# EAGLE design schema (EAGLE 9.6.2)
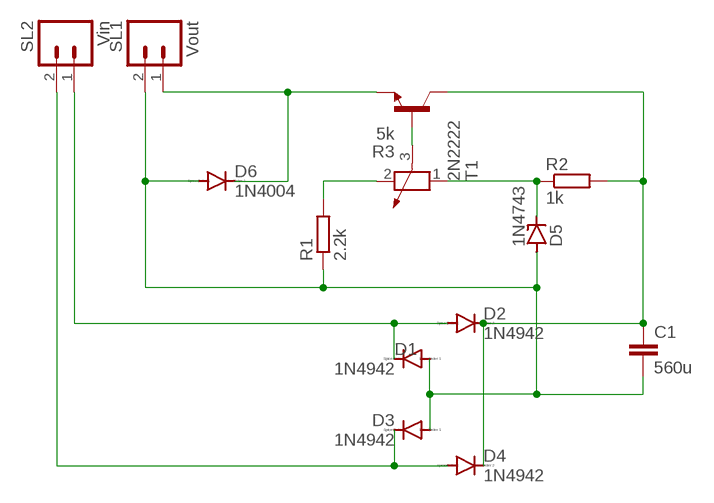
[diagram p0: schematic, sheet 1]

## Parts
C1  560u  C-EU025-025X050  [C025-025X050]
D1  1N4942  [DO41-10]
D2  1N4942  [DO41-10]
D3  1N4942  [DO41-10]
D4  1N4942  [DO41-10]
D5  1N4743  1N4728  [DO41Z10]
D6  1N4004  [DO41-10]
R1  2.2k  R-EU_0204/7  [0204/7]
R2  1k  R-EU_0204/7  [0204/7]
R3  5k  POTENTIOMETER_PT-10  [PT-10]
SL1  Vout  M02  [02P]
SL2  Vin  M02  [02P]
T1  2N2222  [TO18]

## Nets
N$1: D6.C SL1.1 T1.1(E)
N$3: C1.2 D1.A D3.A D5.A D6.A R1.1 SL1.2
N$4: D5.C R2.1 R3.1
N$5: R1.2 R3.2
N$6: R3.3 T1.2(B)
N$7: D3.C D4.A SL2.2
N$8: C1.1 D2.C D4.C R2.2 T1.3(C)
N$9: D1.C D2.A SL2.1

## Library data of the parts
C1 = rcl:C-EU: CAPACITOR, European symbol; SPICEPREFIX: C
D1-D4 = diode:1N4942: DIODE 1.0 A, 200 V, 150 ns
D5 = diode:1N4728: Z DIODE 3.3 V, 1W, 5 percent
D6 = diode:1N4004: DIODE general purpose rectifier, 1 A
R1 R2 = rcl:R-EU_: RESISTOR, European symbol; SPICEPREFIX: R
R3 = rcl:POTENTIOMETER_: Potentiometer; SPICEMODEL: POT; SPICEPREFIX: X
SL1 SL2 = con-amp-quick:M02: AMP QUICK CONNECTOR; OC_FARNELL: unknown; OC_NEWARK: unknown
T1 = transistor:2N2222: NPN TRANSISTOR

## Board
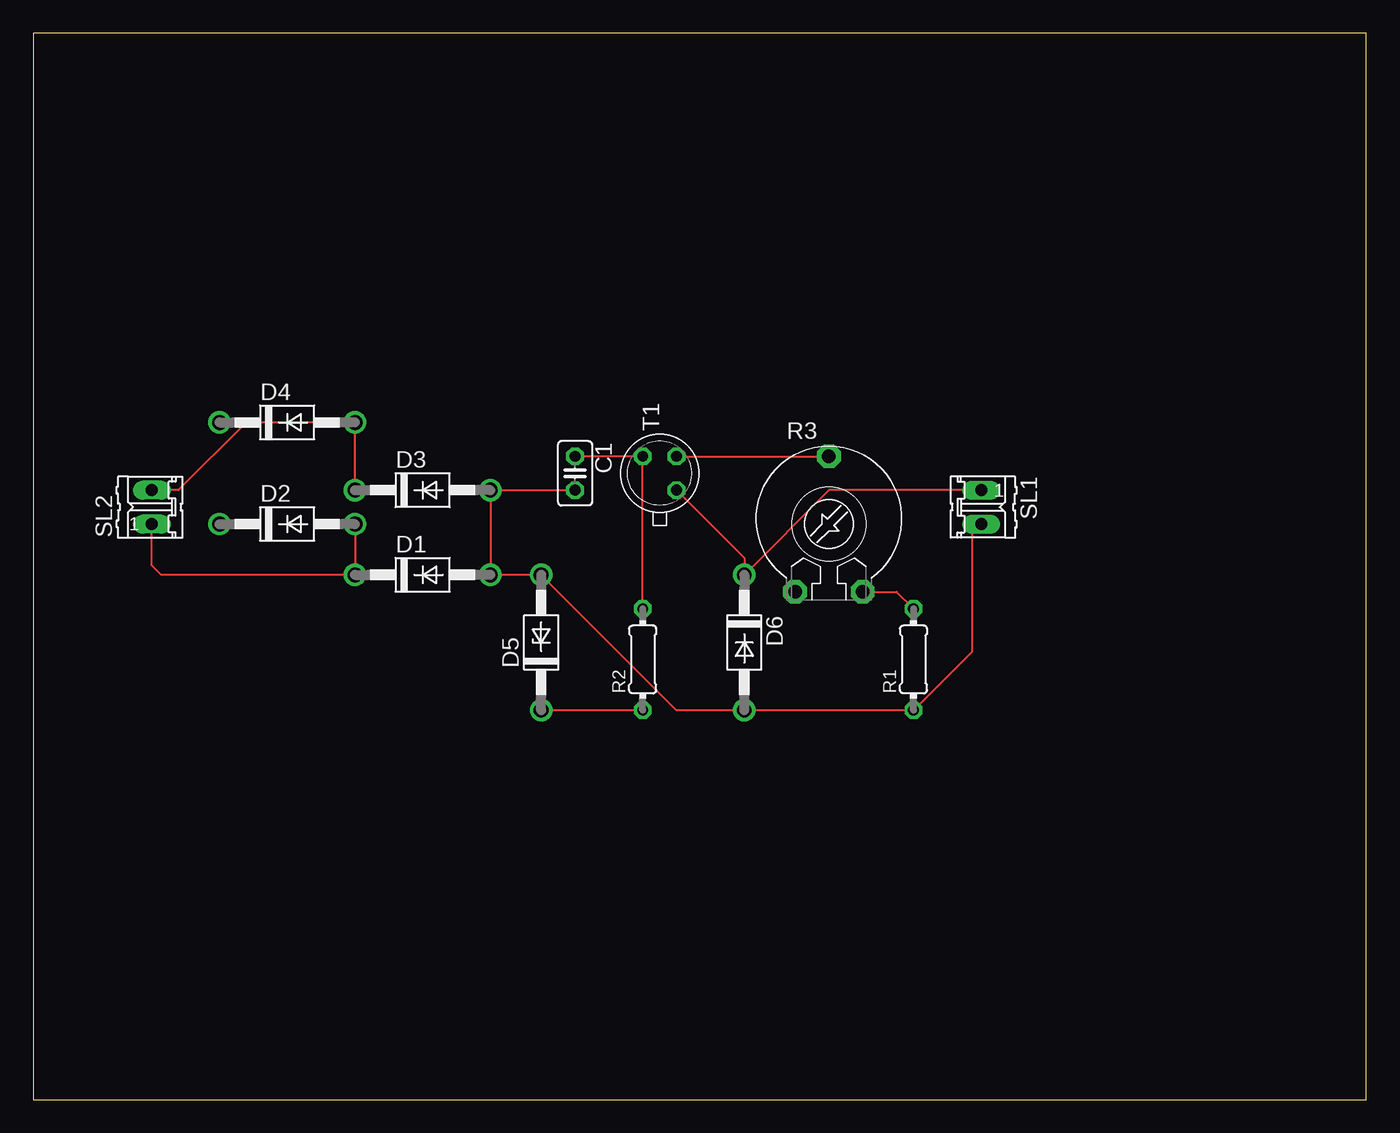
[diagram p1: board, top side]
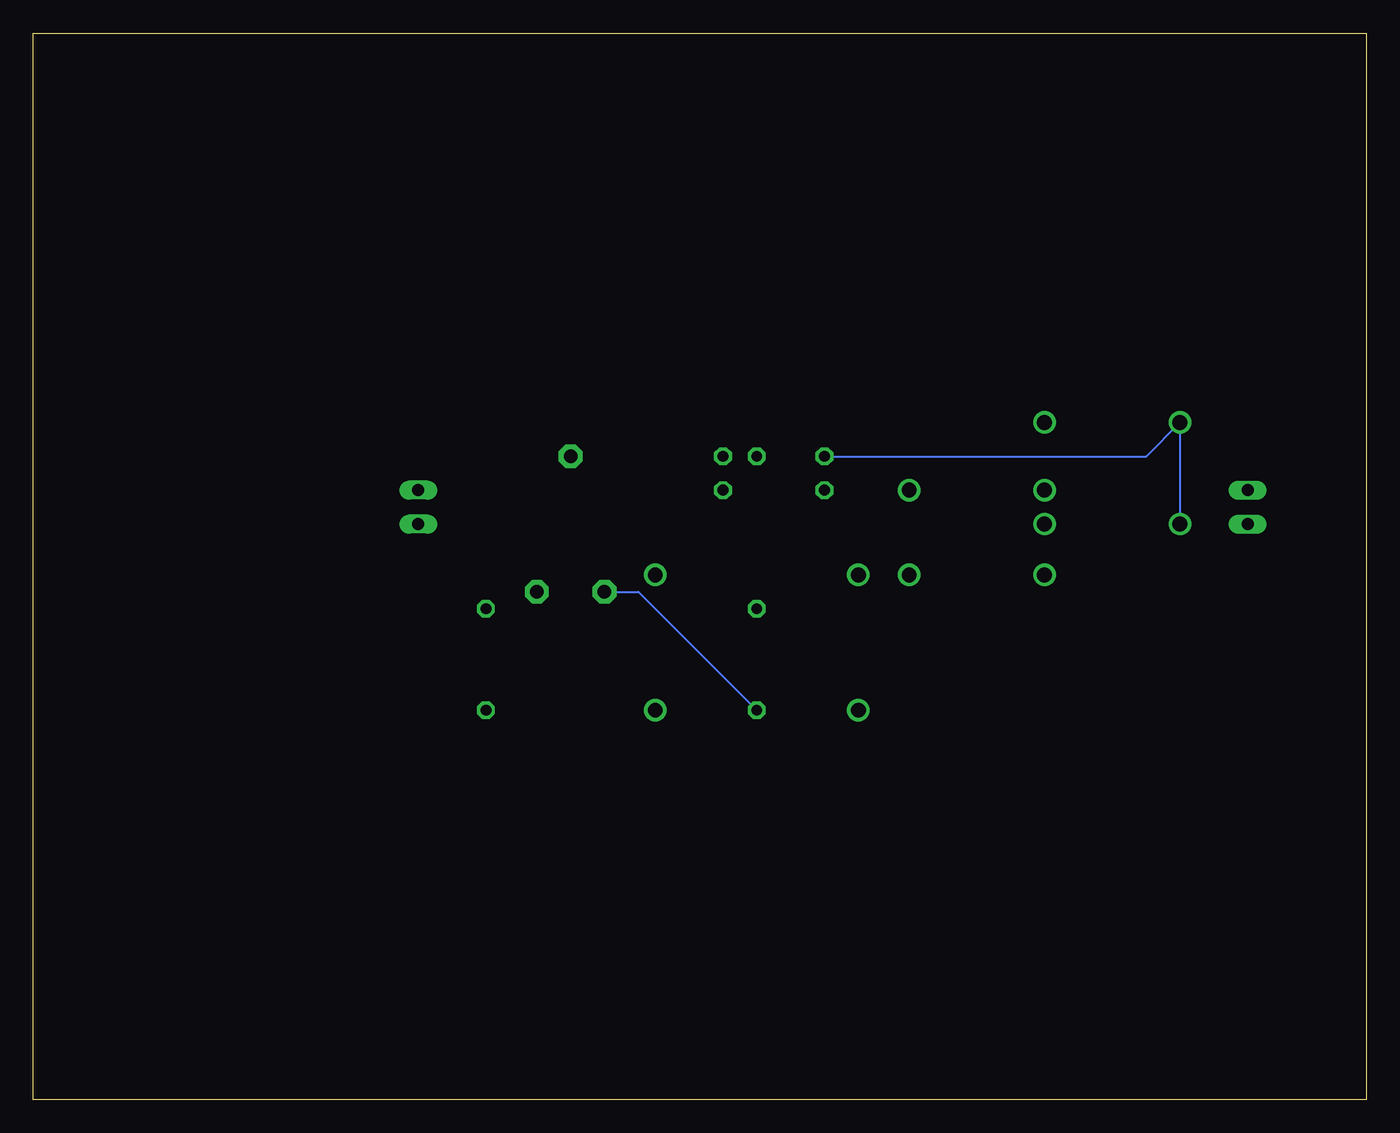
[diagram p2: board, bottom side, seen from below]

Size 100 x 80 mm. Coordinates in mm from the lower left corner, seen from the top.
Outline: 0,0 100,0 100,80 0,80 0,0
Copper layers (1*16): Top 0.035mm / dielectric 1.5mm / Bottom 0.035mm
Design rules "default": minimum track width 6mil, minimum drill 0.35mm, track to track 6mil, track to pad 6mil, pad to pad 6mil, via to via 6mil, smd to smd 6mil, copper to edge 40mil, drill to drill 6mil, minimum pad ring 10mil, minimum via ring 8mil, stop-mask expansion 4mil, vias tented up to drill 0mil, thermal gap 10mil

### Footprints (pad centres in the part's own frame; a part is rotated, then mirrored left to right if it is on the bottom)
C025-025X050 = drill 0.813 octagon: 1 -1.27,0; 2 1.27,0
DO41-10 = drill 1.118: A 5.08,0; C -5.08,0
DO41Z10 = drill 1.118: A 5.08,0; C -5.08,0
0204/7 = drill 0.813 octagon: 1 -3.81,0; 2 3.81,0
PT-10 = drill 1.016 pad 1.778 octagon: 1 -2.54,-5.08; 2 2.54,-5.08; 3 0,5.08
02P = drill 0.914 long: 1 -1.27,0; 2 1.27,0
TO18 = drill 0.813 octagon: 1 -1.27,-1.27; 2 1.27,-1.27; 3 1.27,1.27

### Placement (x,y rotation side)
C1  40.64,46.99 270 top
D1  29.21,39.37 0 top
D2  19.05,43.18 0 top
D3  29.21,45.72 0 top
D4  19.05,50.8 0 top
D5  38.1,34.29 90 top
D6  53.34,34.29 270 top
R1  66.04,33.02 90 top
R2  45.72,33.02 90 top
R3  59.69,43.18 0 top
SL1  71.12,44.45 270 top
SL2  8.89,44.45 90 top
T1  46.99,46.99 90 top

### Tracks (layer width: path | path; a pad name or v marks a point on that pad's centre or on a via)
N$1
  Top 0.152: T1.1 53.34,40.64 D6.C 59.69,45.72 70.41,45.72 SL1.1
N$3
  Top 0.152: C1.2 D3.A D1.A D5.A 48.26,29.21 D6.A R1.1 70.41,33.58 70.41,43.18 SL1.2
N$4
  Top 0.152: R2.1 D5.C
  Bottom 0.152: R3.1 54.61,38.1 R2.1
N$5
  Top 0.152: R3.2 64.77,38.1 R1.2
N$6
  Top 0.152: T1.2 R3.3
N$7
  Top 0.152: SL2.2 10.87,45.72 15.95,50.8 D4.A D3.C
N$8
  Top 0.152: C1.1 T1.3 R2.2
  Bottom 0.152: D2.C D4.C 16.51,48.26 C1.1
N$9
  Top 0.152: SL2.1 8.89,40.08 9.6,39.37 D1.C D2.A